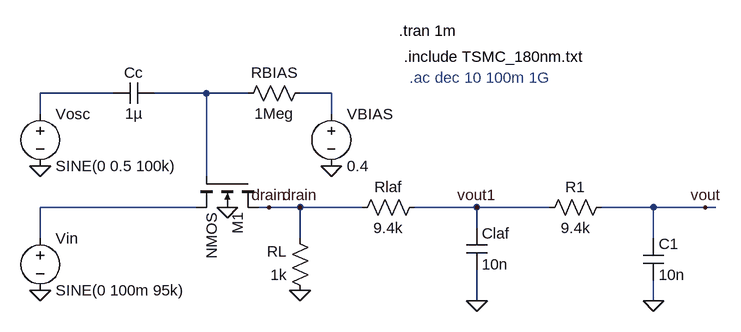
[diagram p0: schematic switch(mixer).asc]
switch(mixer).asc, the LTspice schematic file:
Version 4
SHEET 1 1288 680
WIRE 336 272 224 272
WIRE 480 272 400 272
WIRE 544 272 480 272
WIRE 672 272 624 272
WIRE 224 304 224 272
WIRE 672 304 672 272
WIRE 480 400 480 272
WIRE 464 448 224 448
WIRE 576 448 560 448
WIRE 624 448 576 448
WIRE 720 448 624 448
WIRE 896 448 800 448
WIRE 1008 448 896 448
WIRE 1168 448 1088 448
WIRE 1248 448 1168 448
WIRE 1264 448 1248 448
WIRE 896 480 896 448
WIRE 224 496 224 448
WIRE 624 496 624 448
WIRE 1168 496 1168 448
WIRE 896 592 896 544
WIRE 1168 592 1168 560
FLAG 224 384 0
FLAG 672 384 0
FLAG 224 576 0
FLAG 512 448 0
FLAG 624 576 0
FLAG 896 592 0
FLAG 576 448 drain
FLAG 1168 592 0
FLAG 1248 448 vout
FLAG 896 448 vout1
FLAG 624 448 drain
SYMBOL voltage 224 288 R0
SYMATTR InstName Vosc
SYMATTR Value SINE(0 0.5 100k)
SYMATTR Value2 AC 1
SYMBOL voltage 672 288 R0
SYMATTR InstName VBIAS
SYMATTR Value 0.4
SYMBOL voltage 224 480 R0
SYMATTR InstName Vin
SYMATTR Value SINE(0 100m 95k)
SYMATTR Value2 AC 1
SYMBOL nmos4 560 400 R90
SYMATTR InstName M1
SYMATTR Value2 l=0.18u w=0.4u ad=0.18p as=0.18p pd=1.7u ps=1.7u
SYMBOL res 640 256 R90
WINDOW 0 0 56 VBottom 2
WINDOW 3 32 56 VTop 2
SYMATTR InstName RBIAS
SYMATTR Value 1Meg
SYMBOL res 640 592 R180
WINDOW 0 36 76 Left 2
WINDOW 3 36 40 Left 2
SYMATTR InstName RL
SYMATTR Value 1k
SYMBOL cap 400 256 R90
WINDOW 0 0 32 VBottom 2
WINDOW 3 32 32 VTop 2
SYMATTR InstName Cc
SYMATTR Value 1µ
SYMBOL res 816 432 R90
WINDOW 0 0 56 VBottom 2
WINDOW 3 32 56 VTop 2
SYMATTR InstName Rlaf
SYMATTR Value 9.4k
SYMBOL cap 880 480 R0
SYMATTR InstName Claf
SYMATTR Value 10n
SYMBOL res 1104 432 R90
WINDOW 0 0 56 VBottom 2
WINDOW 3 32 56 VTop 2
SYMATTR InstName R1
SYMATTR Value 9.4k
SYMBOL cap 1152 496 R0
SYMATTR InstName C1
SYMATTR Value 10n
TEXT 776 176 Left 2 !.tran 1m
TEXT 784 216 Left 2 !.include TSMC_180nm.txt
TEXT 792 248 Left 2 ;.ac dec 10 100m 1G

The netlist it stands for:
* switch(mixer).asc
Vosc N001 0 SINE(0 0.5 100k) AC 1
VBIAS N003 0 0.4
Vin N004 0 SINE(0 100m 95k) AC 1
M1 drain N002 N004 0 NMOS l=0.18u w=0.4u ad=0.18p as=0.18p pd=1.7u ps=1.7u
RBIAS N003 N002 1Meg
RL 0 drain 1k
Cc N002 N001 1µ
Rlaf vout1 drain 9.4k
Claf vout1 0 10n
R1 vout vout1 9.4k
C1 vout 0 10n
.model NMOS NMOS
.model PMOS PMOS
.lib standard.mos
.tran 1m
.include TSMC_180nm.txt
* .ac dec 10 100m 1G
.backanno
.end